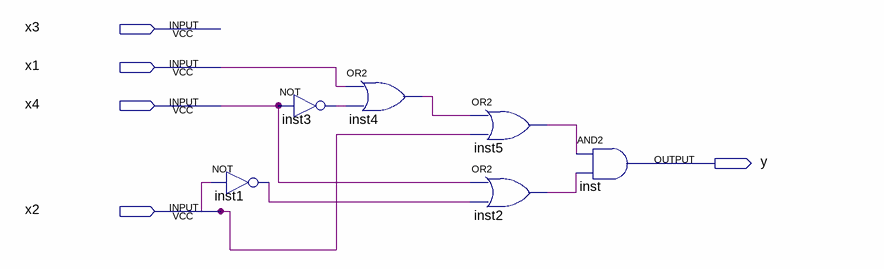
[diagram p0: schematic sheet]
// Quartus schematic lab2.bdf as structural Verilog: 6 symbols, 5 pins
module lab2 (
  input  x3,
  input  x1,
  input  x4,
  input  x2,
  output y
);

  wire inst1_out, inst2_out, inst3_out, inst4_out, inst5_out;

  not inst1 (inst1_out, x2);
  not inst3 (inst3_out, x4);
  or inst4 (inst4_out, x1, inst3_out);
  or inst5 (inst5_out, inst4_out, x2);
  or inst2 (inst2_out, x4, inst1_out);
  and inst (y, inst5_out, inst2_out);
endmodule
